# EAGLE schematic controller (EAGLE 6.6.0)
AUTHOR: Branden Ghena; REV: A; TITLE: Signpost Controller

## Sheet 1 of 5
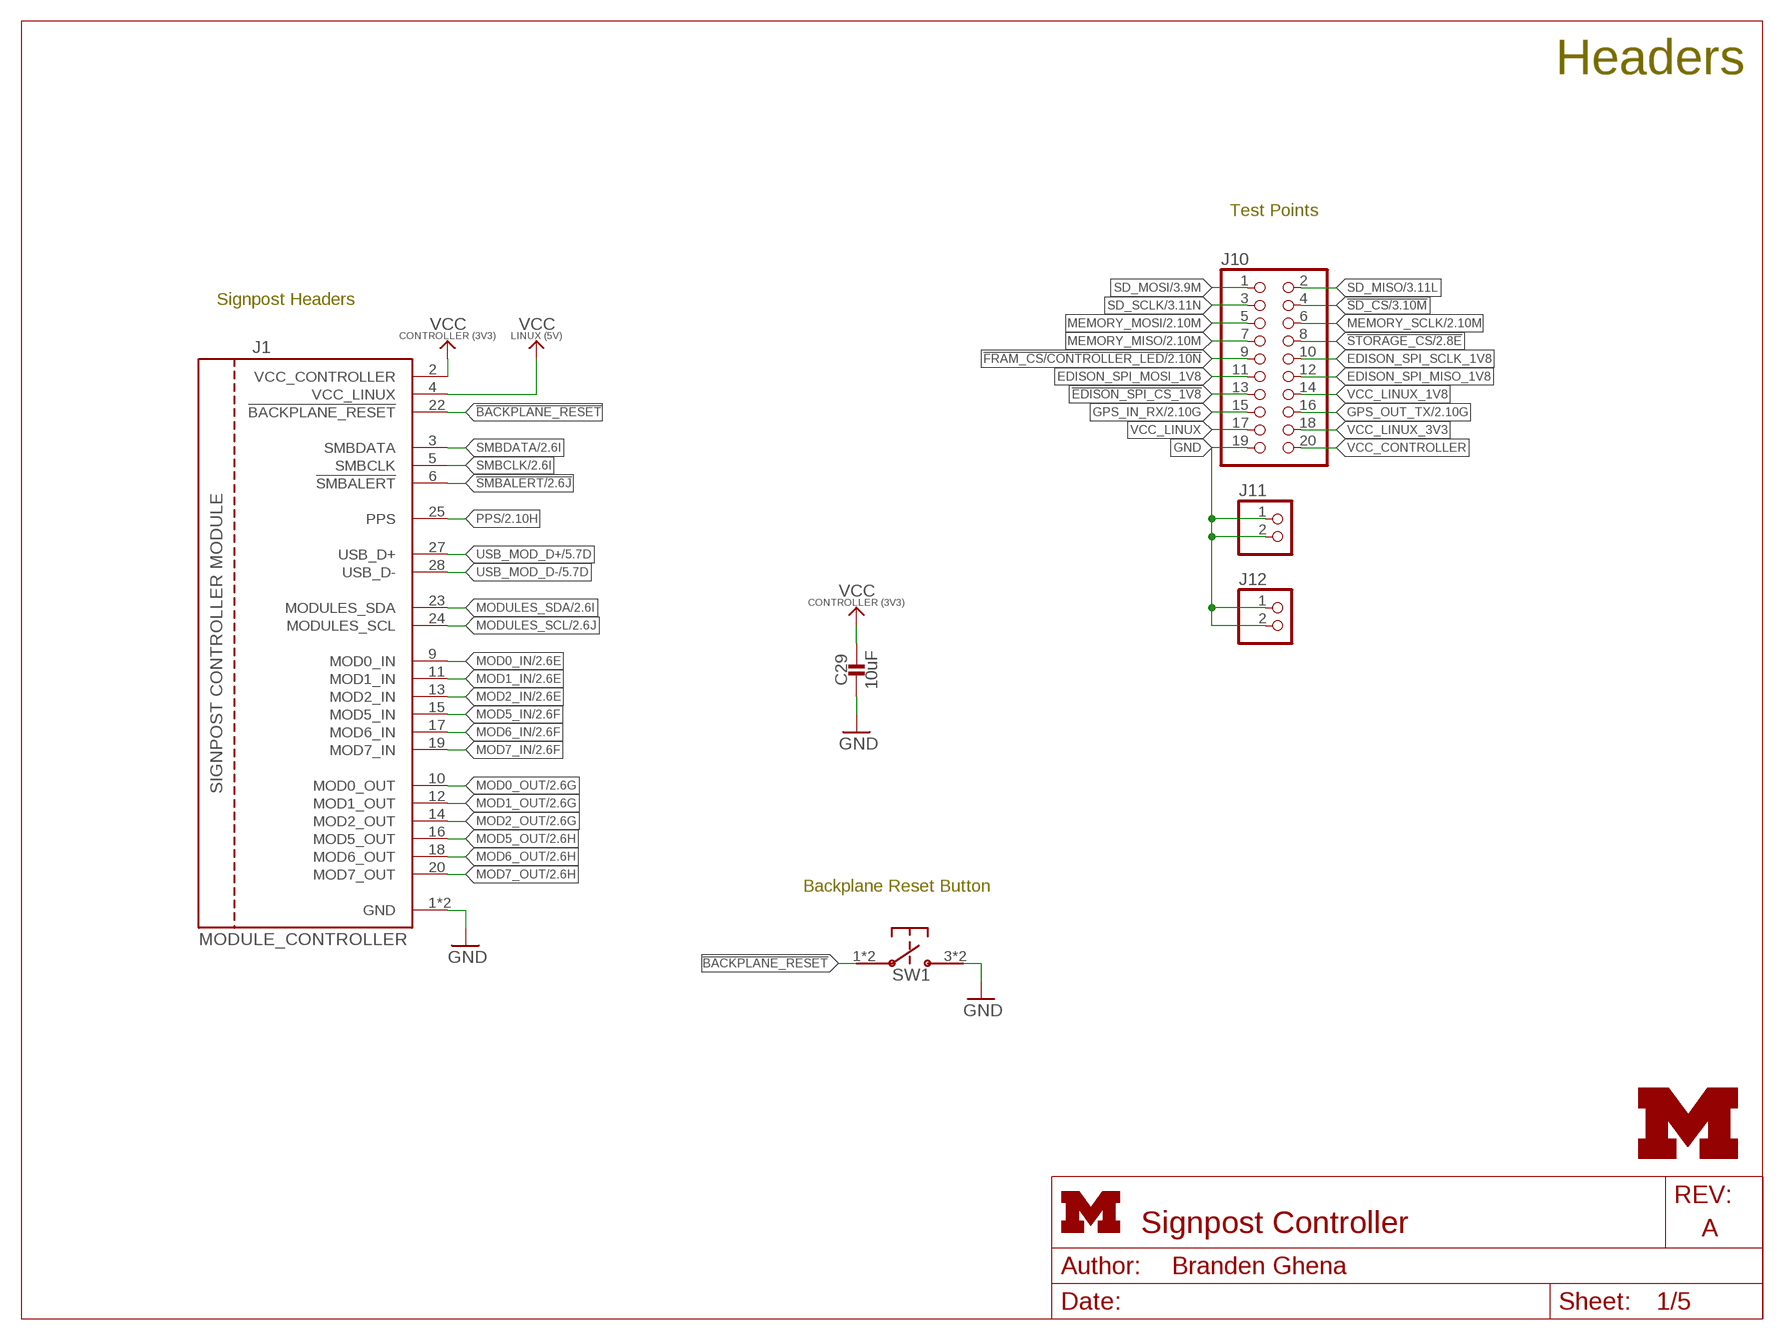
[diagram p0: schematic, sheet 1]
FRAME1 (LETTER_L): HEIGHT: 8.5in; WIDTH: 11in

### Parts
C29  10uF  CAPACITOR0402_CAP  [0402_CAP]
J1  MODULE_CONTROLLER  [MODULE_CONTROLLER]
J10  PINHD-2X10  [2X10]
J11  PINHD-1X2  [1X02]
J12  PINHD-1X2  [1X02]
LOGO1  UMICH_SOLID_MEDIUM  [UMICH_SOLID_200MIL]
SW1  PTS810SJ  [PTS810SJ]

### Nets
!BACKPLANE_RESET: J1.22(!BACKPLANE_RESET) SW1.1 SW1.2
!EDISON_SPI_CS_1V8: J10.13 ; also sheet 4
!FRAM_CS/CONTROLLER_LED: J10.9 ; also sheet 2,3
!SD_CS: J10.4 ; also sheet 3
!SMBALERT: J1.6(!SMBALERT) ; also sheet 2
!STORAGE_CS: J10.8 ; also sheet 2,3
EDISON_SPI_MISO_1V8: J10.12 ; also sheet 4
EDISON_SPI_MOSI_1V8: J10.11 ; also sheet 4
EDISON_SPI_SCLK_1V8: J10.10 ; also sheet 4
GND: C29.2 J1.1(GND) J1.21(GND) J10.19 J11.1 J11.2 J12.1 J12.2 SW1.3 SW1.4 ; also sheet 2,3,4,5
GPS_IN_RX: J10.15 ; also sheet 2
GPS_OUT_TX: J10.16 ; also sheet 2
MEMORY_MISO: J10.7 ; also sheet 2,3
MEMORY_MOSI: J10.5 ; also sheet 2,3
MEMORY_SCLK: J10.6 ; also sheet 2,3
MOD0_IN: J1.9(MOD0_IN) ; also sheet 2
MOD0_OUT: J1.10(MOD0_OUT) ; also sheet 2
MOD1_IN: J1.11(MOD1_IN) ; also sheet 2
MOD1_OUT: J1.12(MOD1_OUT) ; also sheet 2
MOD2_IN: J1.13(MOD2_IN) ; also sheet 2
MOD2_OUT: J1.14(MOD2_OUT) ; also sheet 2
MOD5_IN: J1.15(MOD5_IN) ; also sheet 2
MOD5_OUT: J1.16(MOD5_OUT) ; also sheet 2
MOD6_IN: J1.17(MOD6_IN) ; also sheet 2
MOD6_OUT: J1.18(MOD6_OUT) ; also sheet 2
MOD7_IN: J1.19(MOD7_IN) ; also sheet 2
MOD7_OUT: J1.20(MOD7_OUT) ; also sheet 2
MODULES_SCL: J1.24(MODULES_SCL) ; also sheet 2,3,4
MODULES_SDA: J1.23(MODULES_SDA) ; also sheet 2,3,4
PPS: J1.25(PPS) ; also sheet 2
SD_MISO: J10.2 ; also sheet 3
SD_MOSI: J10.1 ; also sheet 3
SD_SCLK: J10.3 ; also sheet 3
SMBCLK: J1.5(SMBCLK) ; also sheet 2
SMBDATA: J1.3(SMBDATA) ; also sheet 2
USB_MOD_D+: J1.27(USB_D+) ; also sheet 5
USB_MOD_D-: J1.28(USB_D-) ; also sheet 5
VCC_CONTROLLER: C29.1 J1.2(VCC_CONTROLLER) J10.20 ; also sheet 2,3
VCC_LINUX: J1.4(VCC_LINUX) J10.17 ; also sheet 4,5
VCC_LINUX_1V8: J10.14 ; also sheet 4,5
VCC_LINUX_3V3: J10.18 ; also sheet 4,5

### Notes on the sheet
- Headers
- Test Points
- Signpost Headers
- Backplane Reset Button

## Sheet 2 of 5
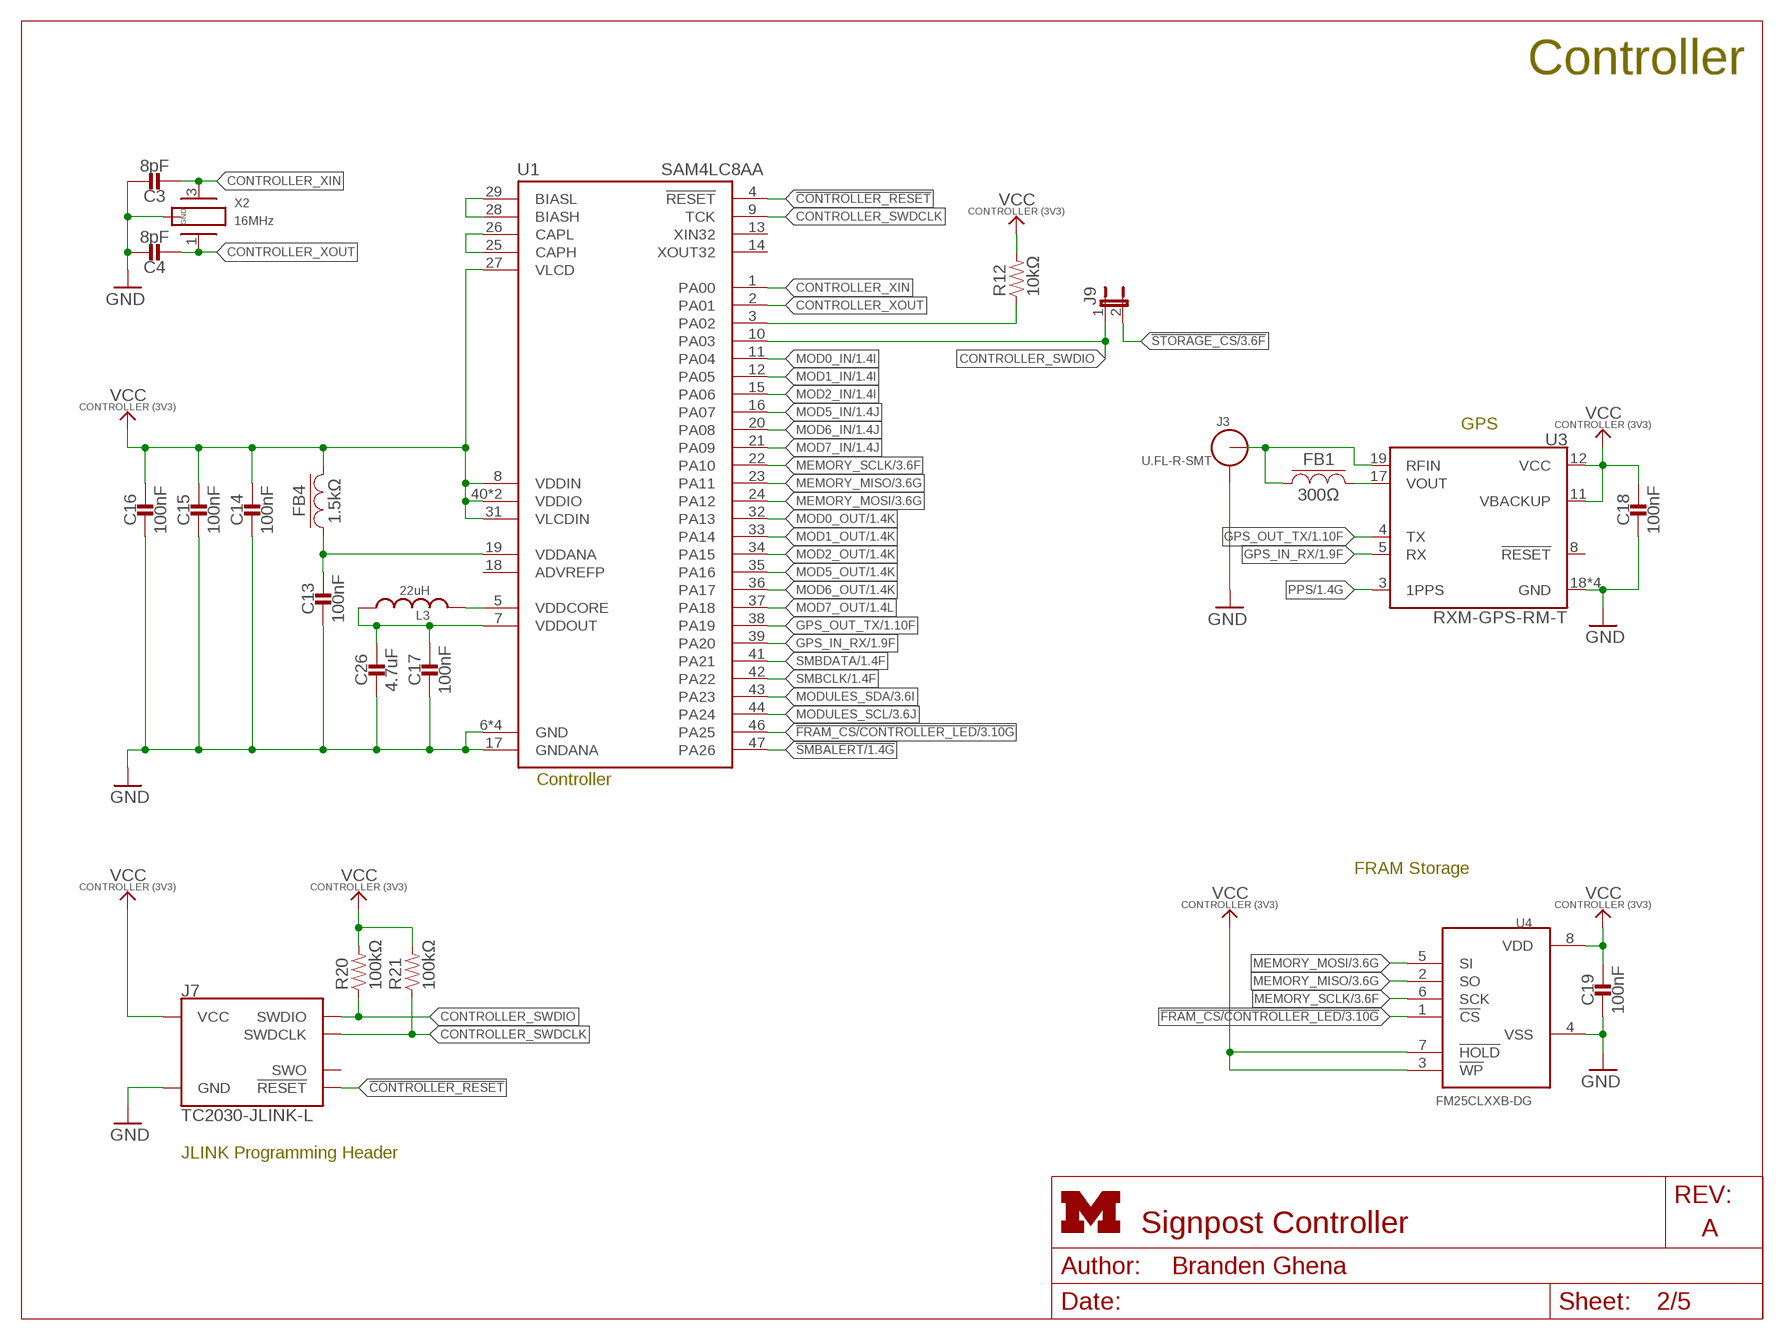
[diagram p1: schematic, sheet 2]
FRAME3 (LETTER_L): HEIGHT: 8.5in; WIDTH: 11in

### Parts
C3  8pF  CAPACITOR0402_CAP  [0402_CAP]
C4  8pF  CAPACITOR0402_CAP  [0402_CAP]
C13  100nF  CAPACITOR0402_CAP  [0402_CAP]
C14  100nF  CAPACITOR0402_CAP  [0402_CAP]
C15  100nF  CAPACITOR0402_CAP  [0402_CAP]
C16  100nF  CAPACITOR0402_CAP  [0402_CAP]
C17  100nF  CAPACITOR0402_CAP  [0402_CAP]
C18  100nF  CAPACITOR0402_CAP  [0402_CAP]
C19  100nF  CAPACITOR0402_CAP  [0402_CAP]
C26  4.7uF  CAPACITOR0402_CAP  [0402_CAP]
FB1  300Ω  FERRITE_BEAD0402  [0402_CAP]
FB4  1.5kΩ  FERRITE_BEAD0402  [0402_CAP]
J3  U.FL-R-SMT  [U.FL_SMT]
J7  TC2030-JLINK-L  [TC2030-IDC]
J9  JUMPER-2PTH  [1X02]
L3  22uH  LHQ3NP  [1212]
R12  10kΩ  RESISTOR0402_RES  [0402_RES]
R20  100kΩ  RESISTOR0402_RES  [0402_RES]
R21  100kΩ  RESISTOR0402_RES  [0402_RES]
U1  SAM4LC8AA  [QFN-48-7MM]
U3  RXM-GPS-RM-T  [RXM-GPS-RM-T]
U4  FM25CLXXB-DG  [TDFN-8]
X2  16MHz  FH1600015  [FHXXX]

### Nets
!CONTROLLER_RESET: J7.3(!RESET) U1.4(!RESET)
!FRAM_CS/CONTROLLER_LED: U1.46(PA25) U4.1(!CS) ; also sheet 1,3
!SMBALERT: U1.47(PA26) ; also sheet 1
!STORAGE_CS: J9.2 ; also sheet 1,3
CONTROLLER_BUCK/LDO_N: R12.1 U1.3(PA02)
CONTROLLER_SWDCLK: J7.4(SWDCLK) R21.1 U1.9(TCK)
CONTROLLER_SWDIO: J7.2(SWDIO) J9.1 R20.1 U1.10(PA03)
CONTROLLER_XIN: C3.1 U1.1(PA00) X2.3
CONTROLLER_XOUT: C4.1 U1.2(PA01) X2.1
GND: C3.2 C4.2 C13.2 C14.2 C15.2 C16.2 C17.2 C18.2 C19.2 C26.2 J3.GND1 J3.GND2 J7.5(GND) U1.6(GND) U1.17(GNDANA) U1.30(GND) U1.48(GND) U1.THERMAL(GND) U3.18(GND) U3.20(GND) U3.21(GND) U3.22(GND) U4.4(VSS) X2.2(GND) X2.4(GND) ; also sheet 1,3,4,5
GPS_IN_RX: U1.39(PA20) U3.5(RX) ; also sheet 1
GPS_OUT_TX: U1.38(PA19) U3.4(TX) ; also sheet 1
MEMORY_MISO: U1.23(PA11) U4.2(SO) ; also sheet 1,3
MEMORY_MOSI: U1.24(PA12) U4.5(SI) ; also sheet 1,3
MEMORY_SCLK: U1.22(PA10) U4.6(SCK) ; also sheet 1,3
MOD0_IN: U1.11(PA04) ; also sheet 1
MOD0_OUT: U1.32(PA13) ; also sheet 1
MOD1_IN: U1.12(PA05) ; also sheet 1
MOD1_OUT: U1.33(PA14) ; also sheet 1
MOD2_IN: U1.15(PA06) ; also sheet 1
MOD2_OUT: U1.34(PA15) ; also sheet 1
MOD5_IN: U1.16(PA07) ; also sheet 1
MOD5_OUT: U1.35(PA16) ; also sheet 1
MOD6_IN: U1.20(PA08) ; also sheet 1
MOD6_OUT: U1.36(PA17) ; also sheet 1
MOD7_IN: U1.21(PA09) ; also sheet 1
MOD7_OUT: U1.37(PA18) ; also sheet 1
MODULES_SCL: U1.44(PA24) ; also sheet 1,3,4
MODULES_SDA: U1.43(PA23) ; also sheet 1,3,4
N$1: FB1.1 U3.17(VOUT)
N$3: FB1.2 J3.SIG(ANT) U3.19(RFIN)
N$32: C13.1 FB4.1 U1.19(VDDANA)
N$44: C17.1 C26.1 L3.P$1 U1.7(VDDOUT)
N$52: L3.P$2 U1.5(VDDCORE)
N$53: U1.28(BIASH) U1.29(BIASL)
N$54: U1.25(CAPH) U1.26(CAPL)
PPS: U3.3(1PPS) ; also sheet 1
SMBCLK: U1.42(PA22) ; also sheet 1
SMBDATA: U1.41(PA21) ; also sheet 1
VCC_CONTROLLER: C14.1 C15.1 C16.1 C18.1 C19.1 FB4.2 J7.1(VCC) R12.2 R20.2 R21.2 U1.8(VDDIN) U1.27(VLCD) U1.31(VLCDIN) U1.40(VDDIO) U1.45(VDDIO) U3.11(VBACKUP) U3.12(VCC) U4.3(!WP) U4.7(!HOLD) U4.8(VDD) ; also sheet 1,3
Unconnected: J7.6(SWO) U1.13(XIN32) U1.14(XOUT32) U1.18(ADVREFP) U3.8(!RESET)

### Notes on the sheet
- Controller
- GPS
- Controller
- FRAM Storage
- JLINK Programming Header

## Sheet 3 of 5
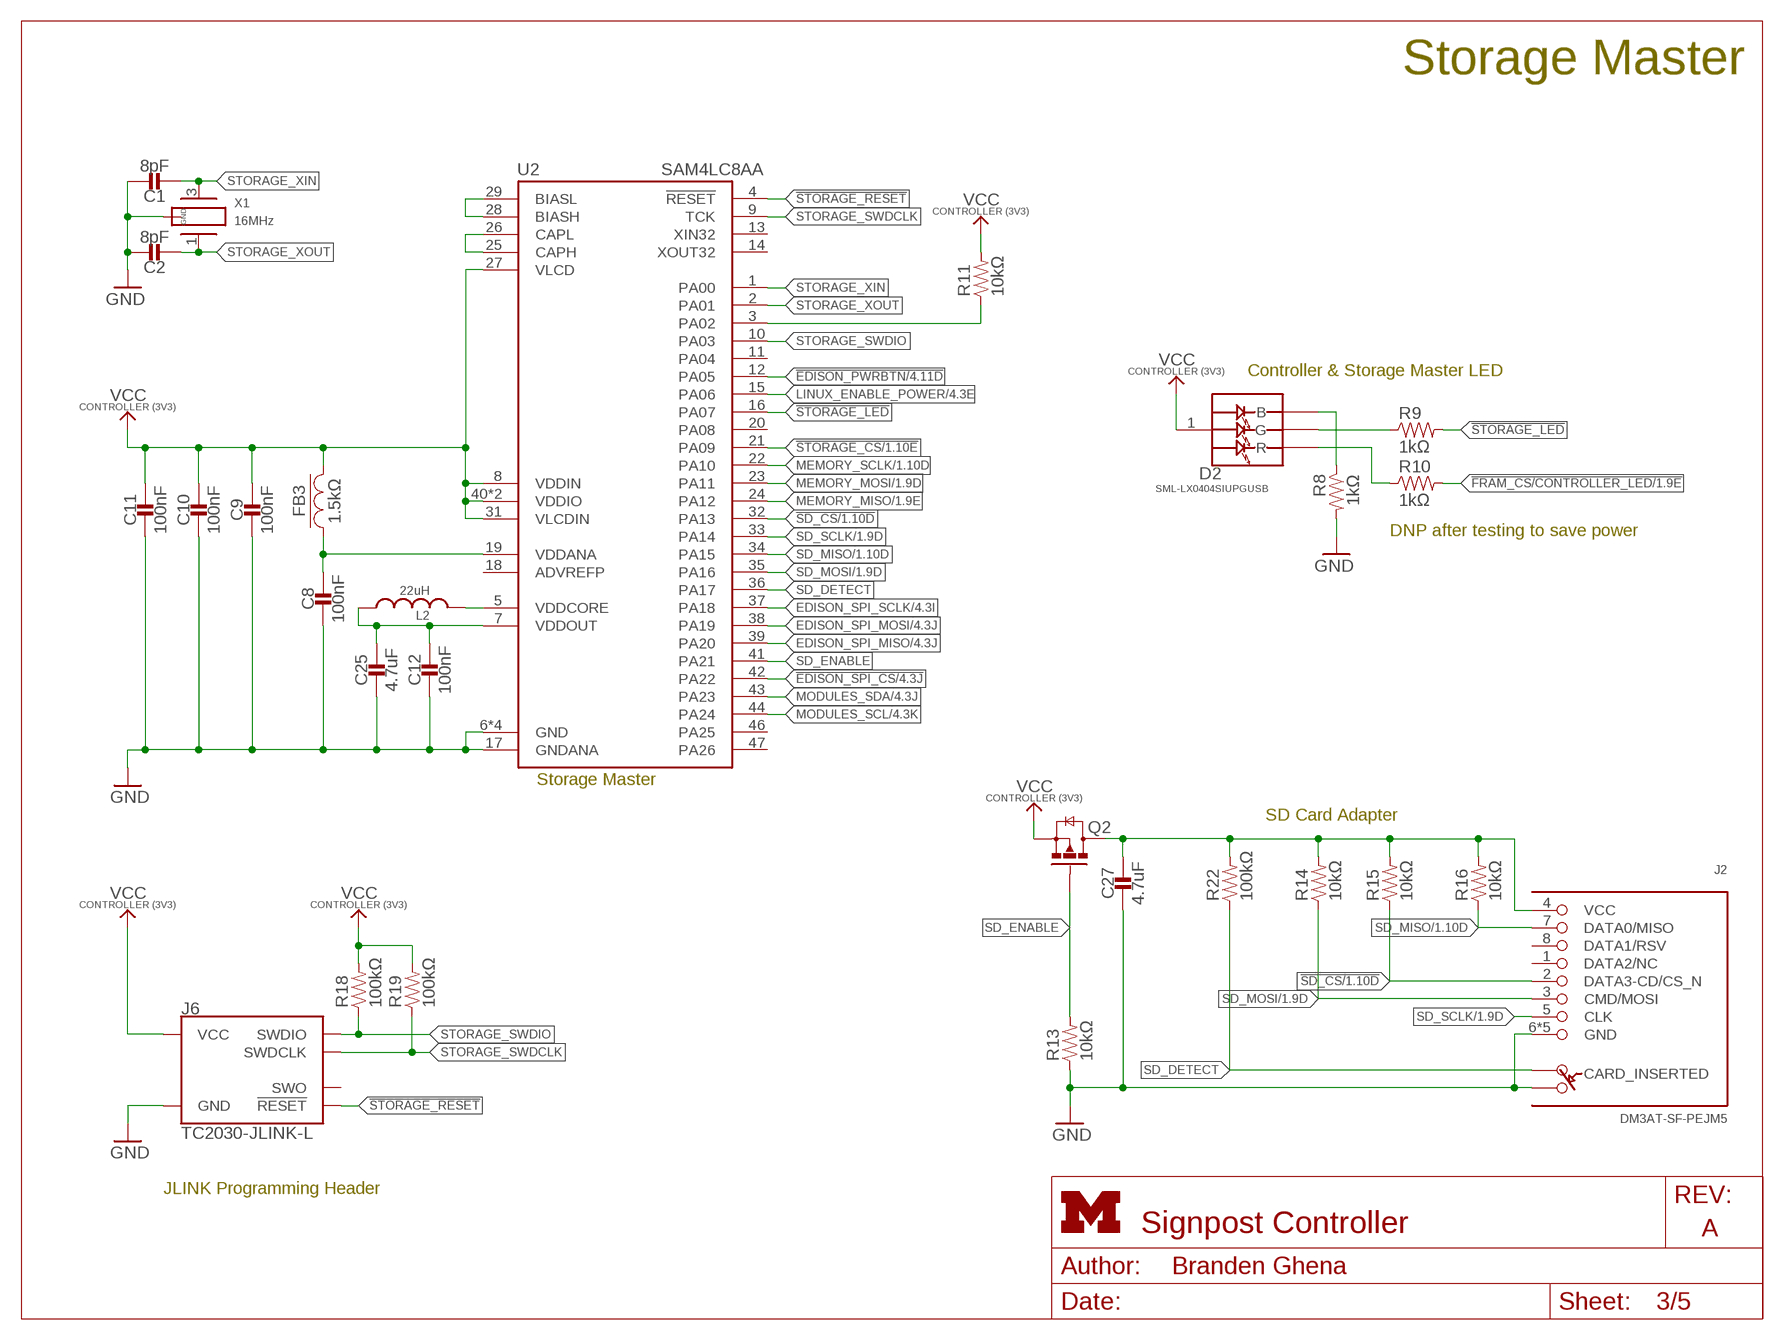
[diagram p2: schematic, sheet 3]
FRAME4 (LETTER_L): HEIGHT: 8.5in; WIDTH: 11in

### Parts
C1  8pF  CAPACITOR0402_CAP  [0402_CAP]
C2  8pF  CAPACITOR0402_CAP  [0402_CAP]
C8  100nF  CAPACITOR0402_CAP  [0402_CAP]
C9  100nF  CAPACITOR0402_CAP  [0402_CAP]
C10  100nF  CAPACITOR0402_CAP  [0402_CAP]
C11  100nF  CAPACITOR0402_CAP  [0402_CAP]
C12  100nF  CAPACITOR0402_CAP  [0402_CAP]
C25  4.7uF  CAPACITOR0402_CAP  [0402_CAP]
C27  4.7uF  CAPACITOR0402_CAP  [0402_CAP]
D2  SML-LX0404SIUPGUSB  [1MM_SQ_4PAD]
FB3  1.5kΩ  FERRITE_BEAD0402  [0402_CAP]
J2  DM3AT-SF-PEJM5  [DM3AT-SF-PEJM5]
J6  TC2030-JLINK-L  [TC2030-IDC]
L2  22uH  LHQ3NP  [1212]
Q2  NX3008PBK  [SOT23-3]
R8  1kΩ  RESISTOR0402_RES  [0402_RES]
R9  1kΩ  RESISTOR0402_RES  [0402_RES]
R10  1kΩ  RESISTOR0402_RES  [0402_RES]
R11  10kΩ  RESISTOR0402_RES  [0402_RES]
R13  10kΩ  RESISTOR0402_RES  [0402_RES]
R14  10kΩ  RESISTOR0402_RES  [0402_RES]
R15  10kΩ  RESISTOR0402_RES  [0402_RES]
R16  10kΩ  RESISTOR0402_RES  [0402_RES]
R18  100kΩ  RESISTOR0402_RES  [0402_RES]
R19  100kΩ  RESISTOR0402_RES  [0402_RES]
R22  100kΩ  RESISTOR0402_RES  [0402_RES]
U2  SAM4LC8AA  [QFN-48-7MM]
X1  16MHz  FH1600015  [FHXXX]

### Nets
!EDISON_PWRBTN: U2.12(PA05) ; also sheet 4
!EDISON_SPI_CS: U2.42(PA22) ; also sheet 4
!FRAM_CS/CONTROLLER_LED: R10.2 ; also sheet 1,2
!SD_CS: J2.2(DATA3-CD/CS_N) R15.1 U2.32(PA13) ; also sheet 1
!STORAGE_CS: U2.21(PA09) ; also sheet 1,2
!STORAGE_LED: R9.2 U2.16(PA07)
!STORAGE_RESET: J6.3(!RESET) U2.4(!RESET)
EDISON_SPI_MISO: U2.39(PA20) ; also sheet 4
EDISON_SPI_MOSI: U2.38(PA19) ; also sheet 4
EDISON_SPI_SCLK: U2.37(PA18) ; also sheet 4
GND: C1.2 C2.2 C8.2 C9.2 C10.2 C11.2 C12.2 C25.2 C27.2 J2.6(GND) J2.B J2.MOUNT0(GND) J2.MOUNT1(GND) J2.MOUNT2(GND) J2.MOUNT3(GND) J6.5(GND) R8.2 R13.1 U2.6(GND) U2.17(GNDANA) U2.30(GND) U2.48(GND) U2.THERMAL(GND) X1.2(GND) X1.4(GND) ; also sheet 1,2,4,5
LINUX_ENABLE_POWER: U2.15(PA06) ; also sheet 4
MEMORY_MISO: U2.24(PA12) ; also sheet 1,2
MEMORY_MOSI: U2.23(PA11) ; also sheet 1,2
MEMORY_SCLK: U2.22(PA10) ; also sheet 1,2
MODULES_SCL: U2.44(PA24) ; also sheet 1,2,4
MODULES_SDA: U2.43(PA23) ; also sheet 1,2,4
N$7: D2.3(B) R8.1
N$8: D2.4(G) R9.1
N$9: D2.2(R) R10.1
N$17: C27.1 J2.4(VCC) Q2.3(D) R14.2 R15.2 R16.2 R22.2
N$29: C8.1 FB3.1 U2.19(VDDANA)
N$45: C12.1 C25.1 L2.P$1 U2.7(VDDOUT)
N$46: L2.P$2 U2.5(VDDCORE)
N$48: U2.25(CAPH) U2.26(CAPL)
N$51: U2.28(BIASH) U2.29(BIASL)
SD_DETECT: J2.A R22.1 U2.36(PA17)
SD_ENABLE: Q2.1(G) R13.2 U2.41(PA21)
SD_MISO: J2.7(DATA0/MISO) R16.1 U2.34(PA15) ; also sheet 1
SD_MOSI: J2.3(CMD/MOSI) R14.1 U2.35(PA16) ; also sheet 1
SD_SCLK: J2.5(CLK) U2.33(PA14) ; also sheet 1
STORAGE_BUCK/LDO_N: R11.1 U2.3(PA02)
STORAGE_SWDCLK: J6.4(SWDCLK) R19.1 U2.9(TCK)
STORAGE_SWDIO: J6.2(SWDIO) R18.1 U2.10(PA03)
STORAGE_XIN: C1.1 U2.1(PA00) X1.3
STORAGE_XOUT: C2.1 U2.2(PA01) X1.1
VCC_CONTROLLER: C9.1 C10.1 C11.1 D2.1(VDD) FB3.2 J6.1(VCC) Q2.2(S) R11.2 R18.2 R19.2 U2.8(VDDIN) U2.27(VLCD) U2.31(VLCDIN) U2.40(VDDIO) U2.45(VDDIO) ; also sheet 1,2
Unconnected: J2.1(DATA2/NC) J2.8(DATA1/RSV) J6.6(SWO) U2.11(PA04) U2.13(XIN32) U2.14(XOUT32) U2.18(ADVREFP) U2.20(PA08) U2.46(PA25) U2.47(PA26)

### Notes on the sheet
- Storage Master
- Controller & Storage Master LED
- DNP after testing to save power
- Storage Master
- SD Card Adapter
- JLINK Programming Header

## Sheet 4 of 5
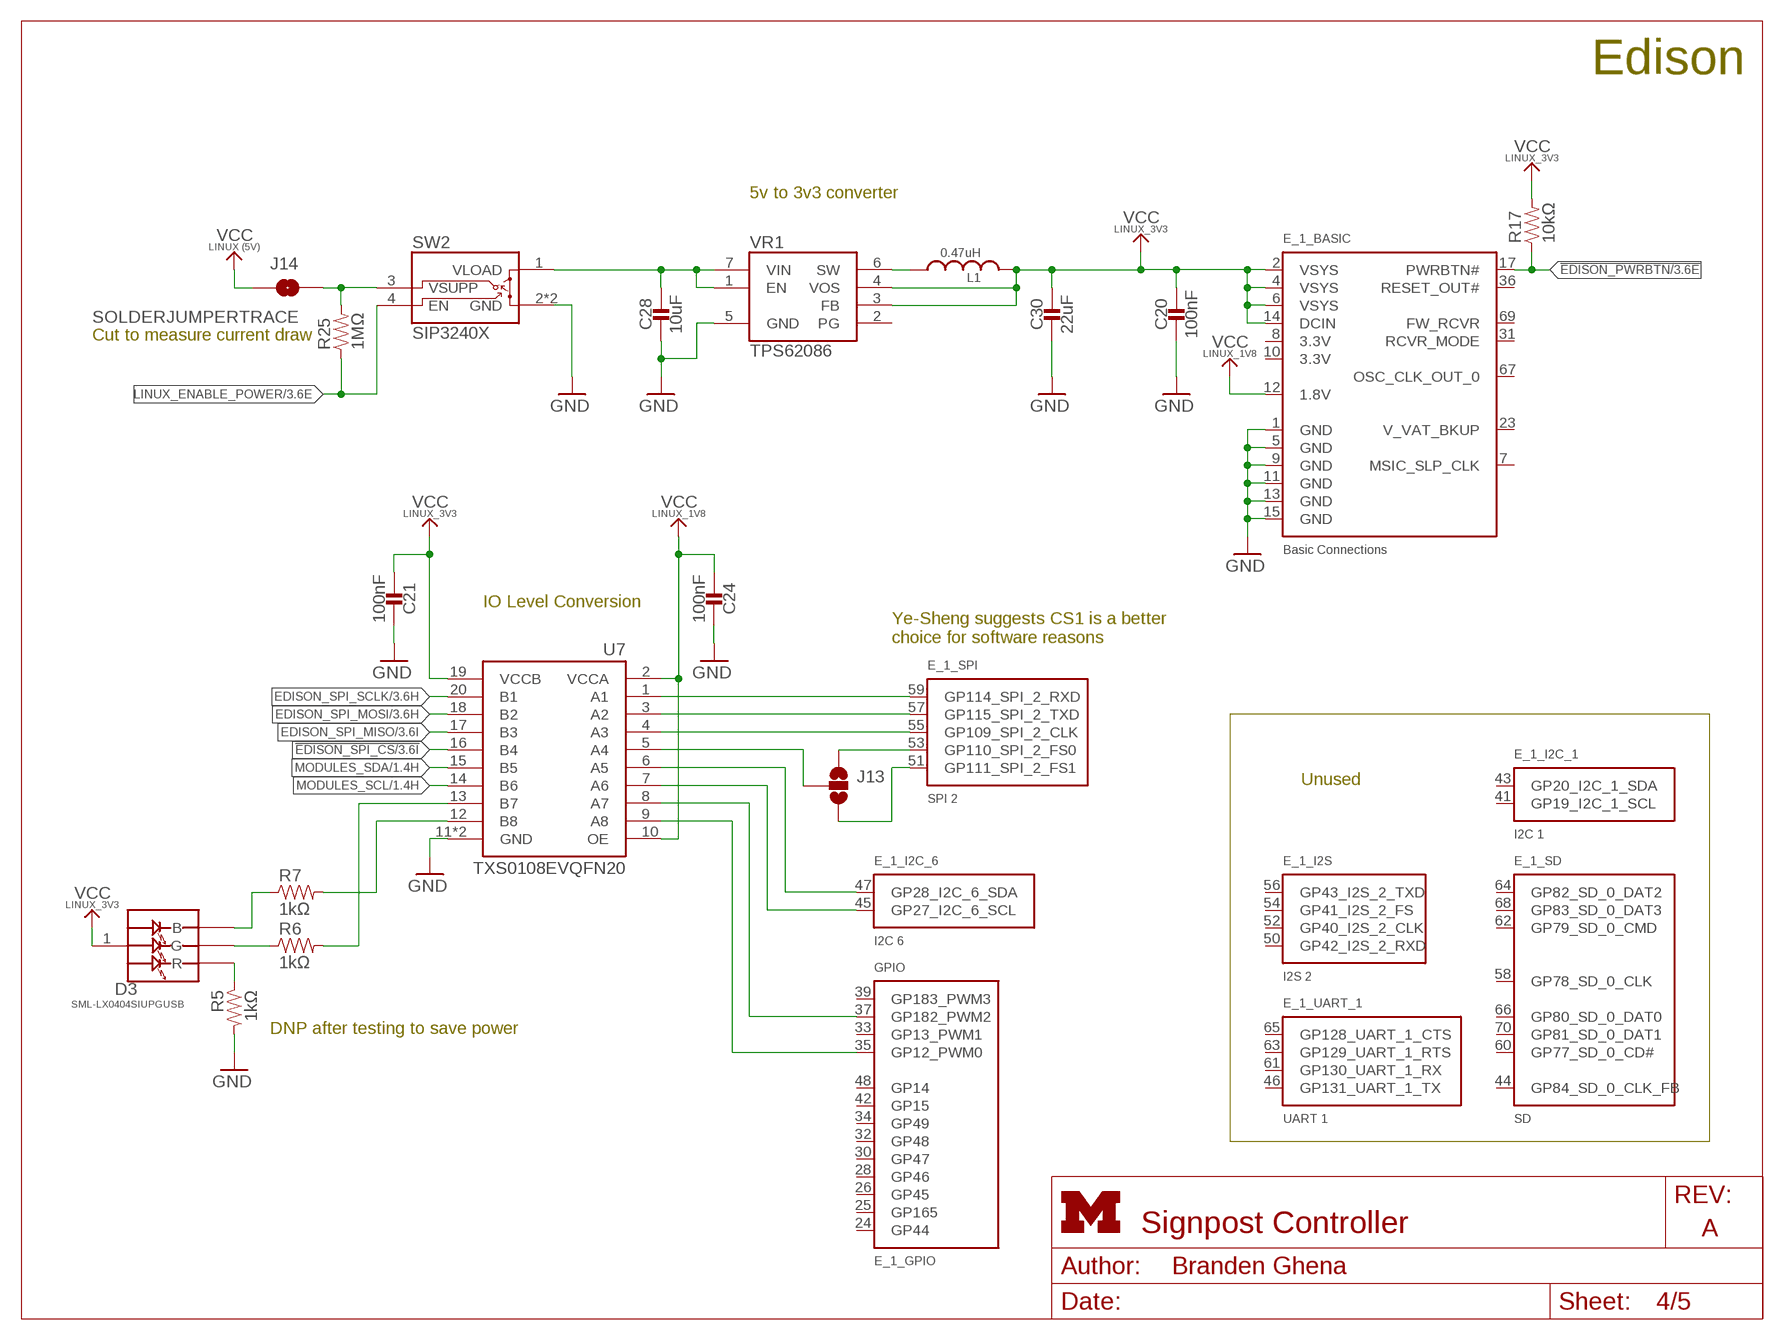
[diagram p3: schematic, sheet 4]
FRAME2 (LETTER_L): HEIGHT: 8.5in; WIDTH: 11in

### Parts
C20  100nF  CAPACITOR0402_CAP  [0402_CAP]
C21  100nF  CAPACITOR0402_CAP  [0402_CAP]
C24  100nF  CAPACITOR0402_CAP  [0402_CAP]
C28  10uF  CAPACITOR0805_CAP  [0805_CAP]
C30  22uF  CAPACITOR0805_CAP  [0805_CAP]
D3  SML-LX0404SIUPGUSB  [1MM_SQ_4PAD]
E_1  EDISON_CONNECTOR_SEGMENTED  [EDISON_DAUGHTER]
J13  SOLDERJUMPER_2WAYPASTE2&3  [SJ_3_PASTE2&3]
J14  SOLDERJUMPERTRACE  [SJ_2S-TRACE]
L1  0.47uH  INDUCTORDFE322512C  [DFE322512C]
R5  1kΩ  RESISTOR0402_RES  [0402_RES]
R6  1kΩ  RESISTOR0402_RES  [0402_RES]
R7  1kΩ  RESISTOR0402_RES  [0402_RES]
R17  10kΩ  RESISTOR0402_RES  [0402_RES]
R25  1MΩ  RESISTOR0402_RES  [0402_RES]
SW2  SIP3240X  [TDFN4]
U7  TXS0108EVQFN20  [R-PVQFN-N20]
VR1  TPS62086  [RLT0007A]

### Nets
!EDISON_PWRBTN: E_1.17(_BASIC:PWRBTN#) R17.1 ; also sheet 3
!EDISON_SPI_CS: U7.16(B4) ; also sheet 3
!EDISON_SPI_CS_1V8: J13.2 U7.5(A4) ; also sheet 1
EDISON_SPI_MISO: U7.17(B3) ; also sheet 3
EDISON_SPI_MISO_1V8: E_1.55(_SPI:GP109_SPI_2_CLK) U7.4(A3) ; also sheet 1
EDISON_SPI_MOSI: U7.18(B2) ; also sheet 3
EDISON_SPI_MOSI_1V8: E_1.57(_SPI:GP115_SPI_2_TXD) U7.3(A2) ; also sheet 1
EDISON_SPI_SCLK: U7.20(B1) ; also sheet 3
EDISON_SPI_SCLK_1V8: E_1.59(_SPI:GP114_SPI_2_RXD) U7.1(A1) ; also sheet 1
GND: C20.2 C21.1 C24.1 C28.P$2 C30.P$2 E_1.1(_BASIC:GND) E_1.5(_BASIC:GND) E_1.9(_BASIC:GND) E_1.11(_BASIC:GND) E_1.13(_BASIC:GND) E_1.15(_BASIC:GND) R5.2 SW2.2(GND) SW2.PAD(GND) U7.11(GND) U7.THERMAL(GND) VR1.5(GND) ; also sheet 1,2,3,5
LINUX_5V_IN: C28.P$1 SW2.1(VLOAD) VR1.1(EN) VR1.7(VIN)
LINUX_ENABLE_POWER: R25.1 SW2.4(EN) ; also sheet 3
MODULES_SCL: U7.14(B6) ; also sheet 1,2,3
MODULES_SCL_1V8: E_1.45(_I2C_6:GP27_I2C_6_SCL) U7.7(A6)
MODULES_SDA: U7.15(B5) ; also sheet 1,2,3
MODULES_SDA_1V8: E_1.47(_I2C_6:GP28_I2C_6_SDA) U7.6(A5)
N$11: E_1.53(_SPI:GP110_SPI_2_FS0) J13.1
N$12: R7.2 U7.12(B8)
N$13: E_1.51(_SPI:GP111_SPI_2_FS1) J13.3
N$14: L1.P$1 VR1.6(SW)
N$18: J14.2 R25.2 SW2.3(VSUPP)
N$31: E_1.37(_GPIO:GP182_PWM2) U7.8(A7)
N$34: D3.2(R) R5.1
N$37: D3.4(G) R6.1
N$38: D3.3(B) R7.1
N$43: E_1.35(_GPIO:GP12_PWM0) U7.9(A8)
N$50: R6.2 U7.13(B7)
VCC_LINUX: J14.1 ; also sheet 1,5
VCC_LINUX_1V8: C24.2 E_1.12(_BASIC:1.8V) U7.2(VCCA) U7.10(OE) ; also sheet 1,5
VCC_LINUX_3V3: C20.1 C21.2 C30.P$1 D3.1(VDD) E_1.2(_BASIC:VSYS) E_1.4(_BASIC:VSYS) E_1.6(_BASIC:VSYS) E_1.14(_BASIC:DCIN) L1.P$2 R17.2 U7.19(VCCB) VR1.3(FB) VR1.4(VOS) ; also sheet 1,5
Unconnected: E_1.7(_BASIC:MSIC_SLP_CLK) E_1.8(_BASIC:3.3V) E_1.10(_BASIC:3.3V) E_1.23(_BASIC:V_VAT_BKUP) E_1.24(_GPIO:GP44) E_1.25(_GPIO:GP165) E_1.26(_GPIO:GP45) E_1.28(_GPIO:GP46) E_1.30(_GPIO:GP47) E_1.31(_BASIC:RCVR_MODE) E_1.32(_GPIO:GP48) E_1.33(_GPIO:GP13_PWM1) E_1.34(_GPIO:GP49) E_1.36(_BASIC:RESET_OUT#) E_1.39(_GPIO:GP183_PWM3) E_1.41(_I2C_1:GP19_I2C_1_SCL) E_1.42(_GPIO:GP15) E_1.43(_I2C_1:GP20_I2C_1_SDA) E_1.44(_SD:GP84_SD_0_CLK_FB) E_1.46(_UART_1:GP131_UART_1_TX) E_1.48(_GPIO:GP14) E_1.50(_I2S:GP42_I2S_2_RXD) E_1.52(_I2S:GP40_I2S_2_CLK) E_1.54(_I2S:GP41_I2S_2_FS) E_1.56(_I2S:GP43_I2S_2_TXD) E_1.58(_SD:GP78_SD_0_CLK) E_1.60(_SD:GP77_SD_0_CD#) E_1.61(_UART_1:GP130_UART_1_RX) E_1.62(_SD:GP79_SD_0_CMD) E_1.63(_UART_1:GP129_UART_1_RTS) E_1.64(_SD:GP82_SD_0_DAT2) E_1.65(_UART_1:GP128_UART_1_CTS) E_1.66(_SD:GP80_SD_0_DAT0) E_1.67(_BASIC:OSC_CLK_OUT_0) E_1.68(_SD:GP83_SD_0_DAT3) E_1.69(_BASIC:FW_RCVR) E_1.70(_SD:GP81_SD_0_DAT1) VR1.2(PG)

### Notes on the sheet
- Edison
- 5v to 3v3 converter
- Cut to measure current draw
- IO Level Conversion
- Ye-Sheng suggests CS1 is a better
  choice for software reasons
- Unused
- DNP after testing to save power

## Sheet 5 of 5
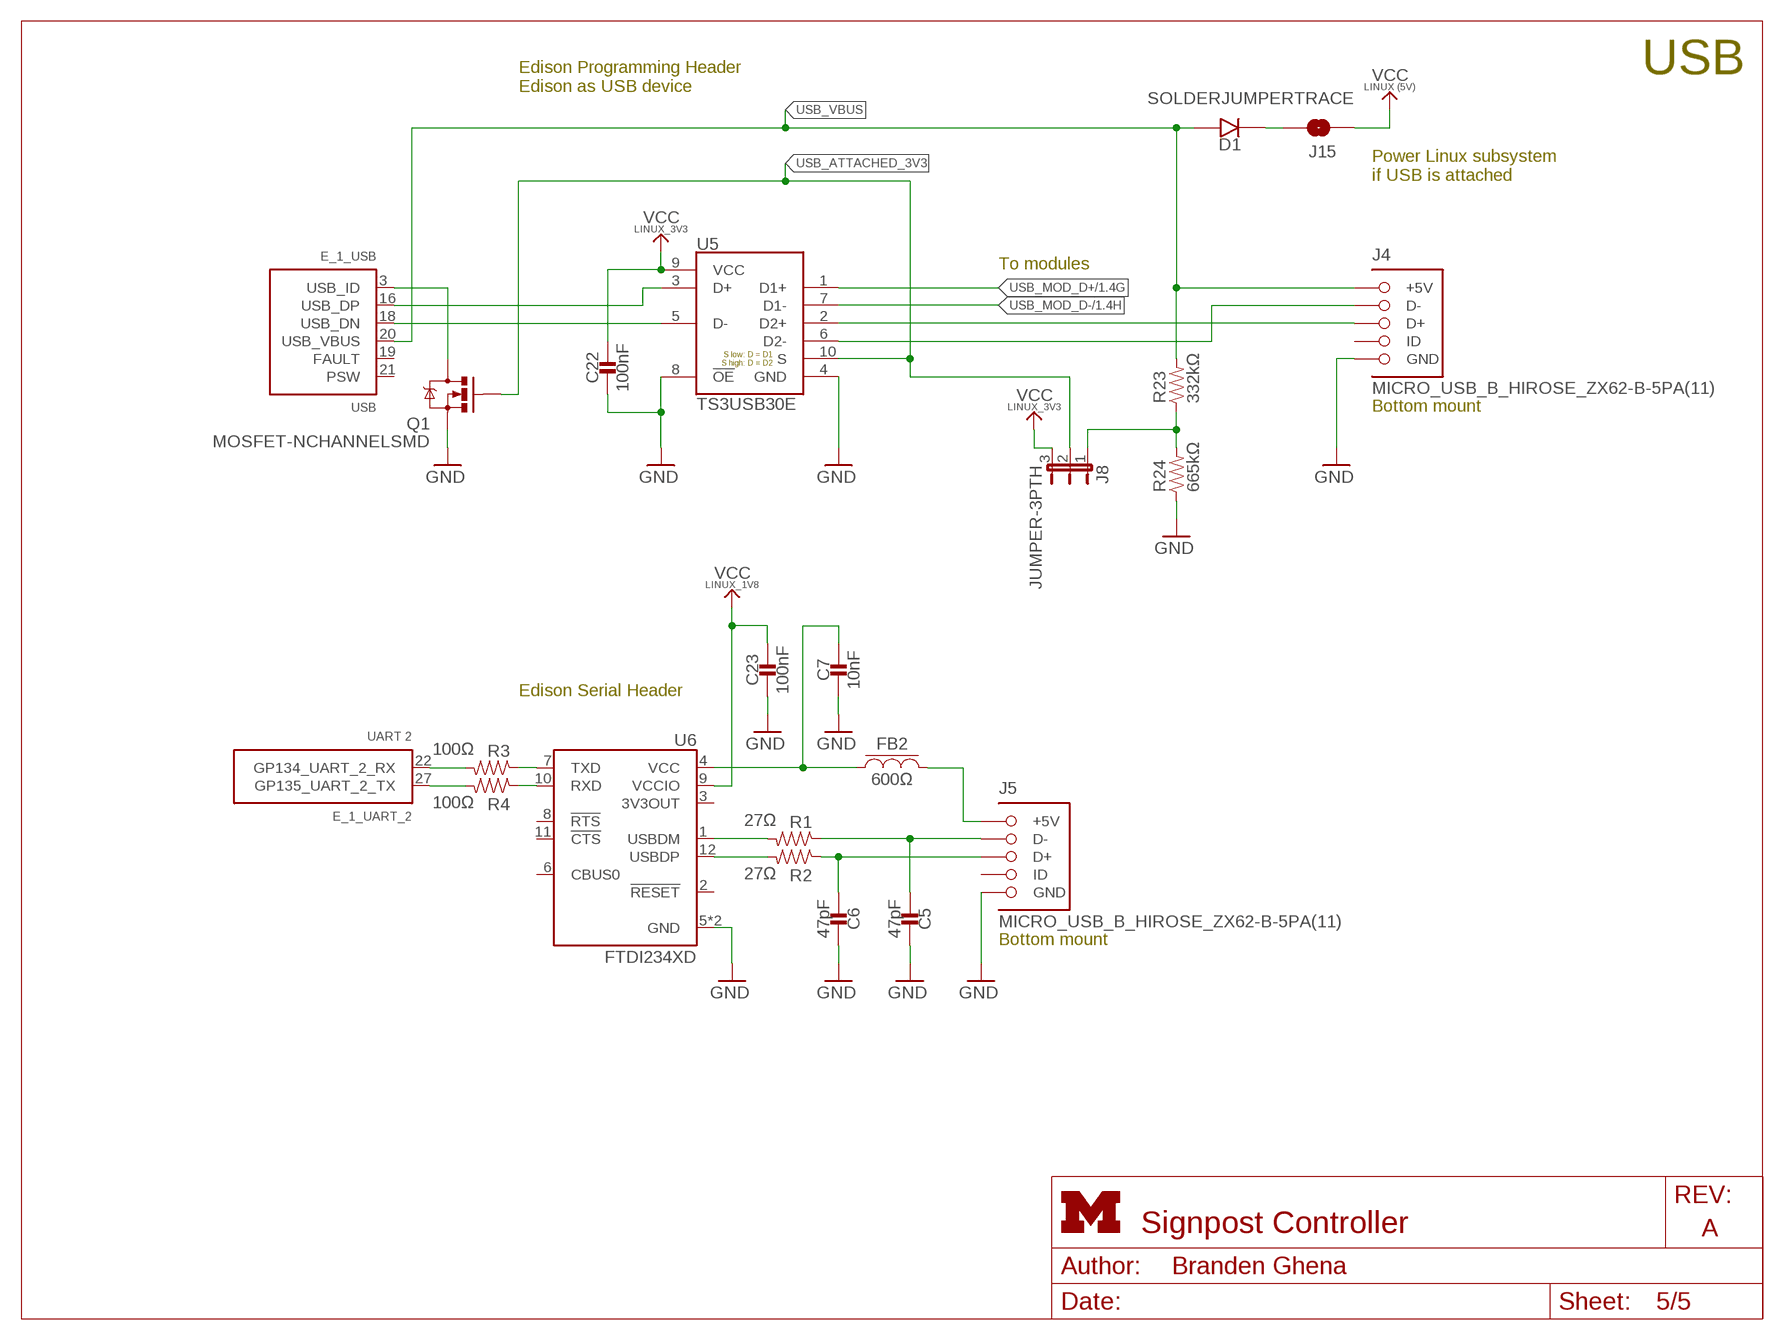
[diagram p4: schematic, sheet 5]
FRAME5 (LETTER_L): HEIGHT: 8.5in; WIDTH: 11in

### Parts
C5  47pF  CAPACITOR0402_CAP  [0402_CAP]
C6  47pF  CAPACITOR0402_CAP  [0402_CAP]
C7  10nF  CAPACITOR0402_CAP  [0402_CAP]
C22  100nF  CAPACITOR0402_CAP  [0402_CAP]
C23  100nF  CAPACITOR0402_CAP  [0402_CAP]
D1  DIODE  [0402_DIODE]
FB2  600Ω  FERRITE_BEAD0805  [0805_CAP]
J4  MICRO_USB_B_HIROSE_ZX62-B-5PA(11)  [USB_MICRO_B-HIROSE-ZX62-B-5PA(11)]
J5  MICRO_USB_B_HIROSE_ZX62-B-5PA(11)  [USB_MICRO_B-HIROSE-ZX62-B-5PA(11)]
J8  JUMPER-3PTH  [1X03]
J15  SOLDERJUMPERTRACE  [SJ_2S-TRACE]
Q1  MOSFET-NCHANNELSMD  [SOT23-3]
R1  27Ω  RESISTOR0402_RES  [0402_RES]
R2  27Ω  RESISTOR0402_RES  [0402_RES]
R3  100Ω  RESISTOR0402_RES  [0402_RES]
R4  100Ω  RESISTOR0402_RES  [0402_RES]
R23  332kΩ  RESISTOR0402_RES  [0402_RES]
R24  665kΩ  RESISTOR0402_RES  [0402_RES]
U5  TS3USB30E  [UQFN-10]
U6  FTDI234XD  [DFN-12/3MM]

### Nets
D+: C6.1 J5.3(D+) R2.1
D-: C5.1 J5.2(D-) R1.1
EDISON_UART_RX: E_1.22(_UART_2:GP134_UART_2_RX) R3.2
EDISON_UART_TX: E_1.27(_UART_2:GP135_UART_2_TX) R4.2
GND: C5.2 C6.2 C7.2 C22.2 C23.2 J4.5(GND) J5.5(GND) Q1.2(S) R24.1 U5.4(GND) U5.8(!OE) U6.5(GND) U6.13(GND) ; also sheet 1,2,3,4
N$2: R1.2 U6.1(USBDM)
N$4: R2.2 U6.12(USBDP)
N$5: J4.2(D-) U5.6(D2-)
N$6: J4.3(D+) U5.2(D2+)
N$10: FB2.P$2 J5.1(+5V)
N$15: D1.CATHODE J15.2
N$16: J8.1 R23.1 R24.2
N$24: R3.1 U6.7(TXD)
N$25: R4.1 U6.10(RXD)
N$28: C7.1 FB2.P$1 U6.4(VCC)
N$30: E_1.3(_USB:USB_ID) Q1.3(D)
USB_ATTACHED_3V3: J8.2 Q1.1(G) U5.10(S)
USB_D+: E_1.16(_USB:USB_DP) U5.3(D+)
USB_D-: E_1.18(_USB:USB_DN) U5.5(D-)
USB_MOD_D+: U5.1(D1+) ; also sheet 1
USB_MOD_D-: U5.7(D1-) ; also sheet 1
USB_VBUS: D1.ANODE E_1.20(_USB:USB_VBUS) J4.1(+5V) R23.2
VCC_LINUX: J15.1 ; also sheet 1,4
VCC_LINUX_1V8: C23.1 U6.9(VCCIO) ; also sheet 1,4
VCC_LINUX_3V3: C22.1 J8.3 U5.9(VCC) ; also sheet 1,4
Unconnected: E_1.19(_USB:FAULT) E_1.21(_USB:PSW) J4.4(ID) J5.4(ID) U6.2(!RESET) U6.3(3V3OUT) U6.6(CBUS0) U6.8(!RTS) U6.11(!CTS)

### Notes on the sheet
- USB
- Edison Programming Header
  Edison as USB device
- Power Linux subsystem
  if USB is attached
- To modules
- Bottom mount
- Edison Serial Header
- Bottom mount

## Library data of the parts
C1-C4 = passives:CAPACITOR: 0402 Capacitor; DIGIKEY: 490-8230-1-ND
C5 C6 = passives:CAPACITOR: 0402 Capacitor; DIGIKEY: 490-6241-1-ND
C7 = passives:CAPACITOR: 0402 Capacitor; DIGIKEY: 490-6296-1-ND
C8-C24 = passives:CAPACITOR: 0402 Capacitor; DIGIKEY: 490-10777-1-ND
C25-C27 = passives:CAPACITOR: 0402 Capacitor; DIGIKEY: 490-13252-1-ND
C28 = passives:CAPACITOR: 0402 Capacitor; DIGIKEY: 490-8316-1-ND
C29 = passives:CAPACITOR: 0402 Capacitor; DIGIKEY: 490-13811-1-ND
C30 = passives:CAPACITOR: 0402 Capacitor; DIGIKEY: 490-1719-1-ND
D1 = passives:DIODE; DIGIKEY: P18981CT-ND
D2 D3 = leds:SML-LX0404SIUPGUSB: 1mm^2 RGB LED; DIGIKEY: 67-2125-1-ND
E_1 = Edison:EDISON_CONNECTOR_SEGMENTED; AMAZON: B00PTVSS4A; MOUSER: 798-DF40HC3070DS4V51
FB1 = passives:FERRITE_BEAD; DIGIKEY: ACML-0402-301-TCT-ND
FB2 = passives:FERRITE_BEAD; DIGIKEY: 240-2390-1-ND
FB3 FB4 = passives:FERRITE_BEAD; DIGIKEY: 490-5216-1-ND
J1 = signpost:MODULE_CONTROLLER: Controller module for signpost; DIGIKEY: S9172-ND , S9169-ND
J2 = connector:DM3AT-SF-PEJM5: CONN MICRO SD R/A PUSH-PUSH SMD; DIGIKEY: HR1964CT-ND
J3 = connector:U.FL-R-SMT: U.FL-R-SMT Antenna Connector; DIGIKEY: H122041-ND
J4 J5 = connector:MICRO_USB_B_HIROSE_ZX62-B-5PA(11): Connector Receptacle USB - micro B 2.0 5 Position Surface Mount, Right Angle, Horizontal Bottom Mount; DIGIKEY: H11634CT-ND; MOUSER: 798-ZX62-B-5PA11; NEWARK: 86P8793
J6 J7 = connector:TC2030-JLINK
J8 = umich:JUMPER-3
J9 = umich:JUMPER-2: Jumper Basic 0.1" spaced jumper. Use with breakaway headers.
J10 = pinhead:PINHD-2X10: PIN HEADER
J11 J12 = pinhead:PINHD-1X2: PIN HEADER
J13 = SparkFun-Passives:SOLDERJUMPER_2WAY: Solder Jumper 2 way solder jumper
J14 J15 = SparkFun-Passives:SOLDERJUMPER: Solder Jumper Standard SMD solder jumper. Used to automate production. Two varients : Normally Open and Normally Closed are the same, but have different paste layers. NC will have a large amount of paste and should jumper during reflow.
L1 = passives:INDUCTOR: A very specific inductor; MOUSER: 81-1277AS-H-R47MP2
L2 L3 = signpost:LHQ3NP: LHQ3NP Inductor; DIGIKEY: 490-5350-1-ND
LOGO1 = logos:UMICH_SOLID
Q1 = fets:MOSFET-NCHANNEL: Generic NMOS footprint; DIGIKEY: SI2312CDS-T1-GE3CT-ND
Q2 = fets:NX3008PBK: MOSFET - P Channel; DIGIKEY: 568-10499-1-ND; MOUSER: 771-NX3008PBK,215; NEWARK: 74T4665
R1 R2 = passives:RESISTOR: Resistor Basic schematic elements and footprints for 0603, 1206, and PTH resistors.; DIGIKEY: 1276-3907-1-ND
R3 R4 = passives:RESISTOR: Resistor Basic schematic elements and footprints for 0603, 1206, and PTH resistors.; DIGIKEY: 1276-3429-1-ND
R5-R10 = passives:RESISTOR: Resistor Basic schematic elements and footprints for 0603, 1206, and PTH resistors.; DIGIKEY: 1276-3430-1-ND
R11-R17 = passives:RESISTOR: Resistor Basic schematic elements and footprints for 0603, 1206, and PTH resistors.; DIGIKEY: 1276-3431-1-ND
R18-R22 = passives:RESISTOR: Resistor Basic schematic elements and footprints for 0603, 1206, and PTH resistors.; DIGIKEY: 1276-3432-1-ND
R23 = passives:RESISTOR: Resistor Basic schematic elements and footprints for 0603, 1206, and PTH resistors.; DIGIKEY: 1276-4245-1-ND
R24 = passives:RESISTOR: Resistor Basic schematic elements and footprints for 0603, 1206, and PTH resistors.; DIGIKEY: 1276-4275-1-ND
R25 = passives:RESISTOR: Resistor Basic schematic elements and footprints for 0603, 1206, and PTH resistors.; DIGIKEY: 1276-3433-1-ND
SW1 = switches:PTS810SJ: PTS810SJ Push Button Switch; DIGIKEY: CKN10504CT-ND
SW2 = signpost:SIP3240X: High power (2.4 A) high-side switch; DIGIKEY: SIP32402ADNP-T1GE4CT-ND
U1 U2 = chips:SAM4LC8AA: Atmel SAM4L microcontroller. ARM Cortex M4 with 512 KB Flash and 64 KB RAM; DIGIKEY: ATSAM4LC8AA-MU-ND
U3 = chips:RXM-GPS-RM-T: The RM Series GPS receiver module is a self-contained high-performance Global Positioning System receiver; DIGIKEY: RXM-GPS-RM-TCT-ND
U4 = chips:FM25: Cypress FRAM; DIGIKEY: FM25CL64B-DGRA-ND
U5 = signpost:TS3USB30E: USB Mux with OE control and ESD; DIGIKEY: 296-24684-1-ND
U6 = chips:FTDI234XD: FTDI234XD USB to UART Bridge in 3x3 DFN Package; DIGIKEY: 768-1178-1-ND; MOUSER: 895-FT234XD-R; NEWARK: 53X3171
U7 = chips:TXS0108E: TXS0108E 8-Bit Bi-directional Voltage Translator; DIGIKEY: 296-24806-1-ND
VR1 = regulators:TPS62086: Buck Switching Regulator IC Positive Fixed 3.3V 1 Output 3A 7-VFDFN; DIGIKEY: 296-40831-1-ND
X1 X2 = crystals:FH1600015: Pericom Type FH 16 MHz 2.5 x 2.0 mm; DIGIKEY: FH1600015CT-ND